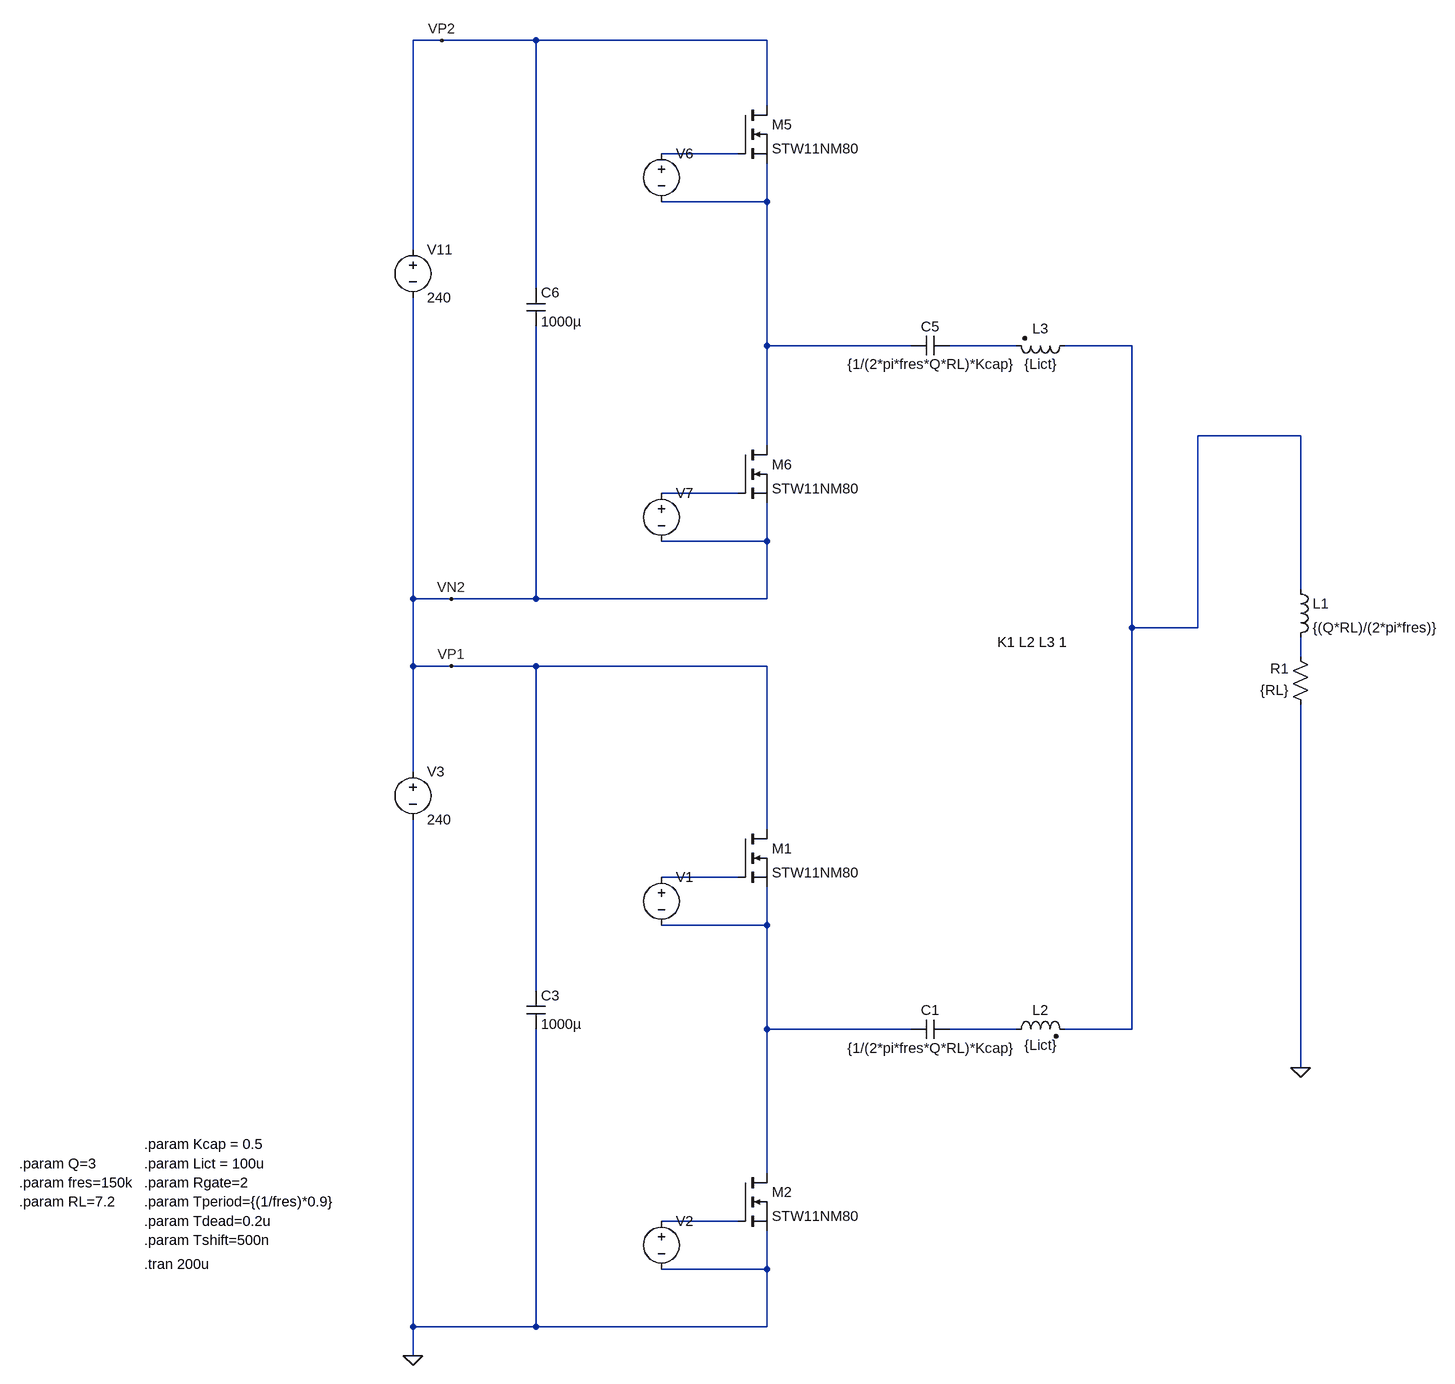
[diagram p0: schematic inv_sim12.asc]
inv_sim12.asc, the LTspice schematic file:
Version 4
SHEET 1 2752 948
WIRE -416 -1568 -464 -1568
WIRE -32 -1568 -416 -1568
WIRE 608 -1568 -32 -1568
WIRE 608 -1296 608 -1568
WIRE 560 -1216 432 -1216
WIRE 608 -1136 608 -1200
WIRE 608 -1136 432 -1136
WIRE -464 -1056 -464 -1568
WIRE -32 -992 -32 -1568
WIRE 608 -896 608 -1136
WIRE 848 -896 608 -896
WIRE 1024 -896 912 -896
WIRE 1280 -896 1104 -896
WIRE 2416 -704 1888 -704
WIRE 608 -688 608 -896
WIRE 560 -608 432 -608
WIRE 608 -528 608 -592
WIRE 608 -528 432 -528
WIRE 2416 -448 2416 -704
WIRE -464 -432 -464 -976
WIRE -400 -432 -464 -432
WIRE -32 -432 -32 -928
WIRE -32 -432 -400 -432
WIRE 608 -432 608 -528
WIRE 608 -432 -32 -432
WIRE 1280 -384 1280 -896
WIRE 1888 -384 1888 -704
WIRE 1888 -384 1280 -384
WIRE 2416 -336 2416 -368
WIRE -464 -320 -464 -432
WIRE -400 -320 -464 -320
WIRE -32 -320 -400 -320
WIRE 608 -320 -32 -320
WIRE -464 -144 -464 -320
WIRE 608 -48 608 -320
WIRE 560 32 432 32
WIRE 608 112 608 48
WIRE 608 112 432 112
WIRE -32 256 -32 -320
WIRE 608 320 608 112
WIRE 848 320 608 320
WIRE 1024 320 912 320
WIRE 1280 320 1280 -384
WIRE 1280 320 1104 320
WIRE 2416 384 2416 -256
WIRE 608 560 608 320
WIRE 560 640 432 640
WIRE 608 720 608 656
WIRE 608 720 432 720
WIRE -464 816 -464 -64
WIRE -32 816 -32 320
WIRE -32 816 -464 816
WIRE 608 816 608 720
WIRE 608 816 -32 816
WIRE -464 864 -464 816
FLAG -464 864 0
FLAG -416 -1568 VP2
FLAG -400 -432 VN2
FLAG -400 -320 VP1
FLAG 2416 384 0
SYMBOL nmos 560 -48 R0
SYMATTR InstName M1
SYMATTR Value STW11NM80
SYMBOL nmos 560 560 R0
SYMATTR InstName M2
SYMATTR Value STW11NM80
SYMBOL voltage 432 16 R0
WINDOW 3 24 96 Invisible 2
WINDOW 123 0 0 Left 2
SYMATTR Value PULSE(0 15 0 50n 50n {Tperiod / 2 - Tdead} {Tperiod})
SYMATTR InstName V1
SYMATTR SpiceLine Rser={Rgate}
SYMBOL voltage -464 -160 R0
WINDOW 123 0 0 Left 2
WINDOW 39 0 0 Left 2
SYMATTR InstName V3
SYMATTR Value 240
SYMBOL voltage 432 624 R0
WINDOW 3 24 96 Invisible 2
WINDOW 123 0 0 Left 2
SYMATTR Value PULSE(0 15 {2 * Tperiod / 4} 50n 50n {Tperiod / 2 - Tdead} {Tperiod})
SYMATTR InstName V2
SYMATTR SpiceLine Rser={Rgate}
SYMBOL ind 2400 -464 R0
SYMATTR InstName L1
SYMATTR Value {(Q*RL)/(2*pi*fres)}
SYMBOL res 2432 -240 R180
WINDOW 0 36 76 Left 2
WINDOW 3 36 40 Left 2
SYMATTR InstName R1
SYMATTR Value {RL}
SYMBOL cap -48 256 R0
SYMATTR InstName C3
SYMATTR Value 1000µ
SYMBOL nmos 560 -1296 R0
SYMATTR InstName M5
SYMATTR Value STW11NM80
SYMBOL nmos 560 -688 R0
SYMATTR InstName M6
SYMATTR Value STW11NM80
SYMBOL voltage 432 -1232 R0
WINDOW 3 24 96 Invisible 2
WINDOW 123 0 0 Left 2
SYMATTR Value PULSE(0 15 {Tshift} 50n 50n {Tperiod / 2 - Tdead} {Tperiod})
SYMATTR InstName V6
SYMATTR SpiceLine Rser={Rgate}
SYMBOL voltage 432 -624 R0
WINDOW 3 24 96 Invisible 2
WINDOW 123 0 0 Left 2
SYMATTR Value PULSE(0 15 {2 * Tperiod / 4 + Tshift} 50n 50n {Tperiod / 2 - Tdead} {Tperiod})
SYMATTR InstName V7
SYMATTR SpiceLine Rser={Rgate}
SYMBOL cap 912 -912 R90
WINDOW 0 0 32 VBottom 2
WINDOW 3 32 32 VTop 2
SYMATTR InstName C5
SYMATTR Value {1/(2*pi*fres*Q*RL)*Kcap}
SYMBOL cap -48 -992 R0
SYMATTR InstName C6
SYMATTR Value 1000µ
SYMBOL voltage -464 -1072 R0
WINDOW 123 0 0 Left 2
WINDOW 39 0 0 Left 2
SYMATTR InstName V11
SYMATTR Value 240
SYMBOL ind2 1120 -912 R90
WINDOW 0 4 56 VBottom 2
WINDOW 3 32 56 VTop 2
SYMATTR InstName L3
SYMATTR Value {Lict}
SYMATTR Type ind
SYMBOL ind2 1008 336 R270
WINDOW 0 32 56 VTop 2
WINDOW 3 5 56 VBottom 2
SYMATTR InstName L2
SYMATTR Value {Lict}
SYMATTR Type ind
SYMBOL cap 912 304 R90
WINDOW 0 0 32 VBottom 2
WINDOW 3 32 32 VTop 2
SYMATTR InstName C1
SYMATTR Value {1/(2*pi*fres*Q*RL)*Kcap}
TEXT -1064 576 Left 2 !.param Rgate=2
TEXT -1064 712 Left 2 !.tran 200u
TEXT -1064 608 Left 2 !.param Tperiod={(1/fres)*0.9}
TEXT -1064 640 Left 2 !.param Tdead=0.2u
TEXT -1272 544 Left 2 !.param Q=3
TEXT -1272 576 Left 2 !.param fres=150k
TEXT -1272 608 Left 2 !.param RL=7.2
TEXT -1064 672 Left 2 !.param Tshift=500n
TEXT -1064 544 Left 2 !.param Lict = 100u
TEXT 992 -360 Left 2 !K1 L2 L3 1
TEXT -1064 512 Left 2 !.param Kcap = 0.5

The netlist it stands for:
* inv_sim12.asc
M1 VP1 N007 N008 N008 STW11NM80
M2 N008 N010 0 0 STW11NM80
V1 N007 N008 PULSE(0 15 0 50n 50n {Tperiod / 2 - Tdead} {Tperiod}) Rser={Rgate}
V3 VP1 0 240
V2 N010 0 PULSE(0 15 {2 * Tperiod / 4} 50n 50n {Tperiod / 2 - Tdead} {Tperiod}) Rser={Rgate}
L1 N004 N006 {(Q*RL)/(2*pi*fres)}
R1 0 N006 {RL}
C3 VP1 0 1000µ
M5 VP2 N001 N002 N002 STW11NM80
M6 N002 N005 VP1 VP1 STW11NM80
V6 N001 N002 PULSE(0 15 {Tshift} 50n 50n {Tperiod / 2 - Tdead} {Tperiod}) Rser={Rgate}
V7 N005 VP1 PULSE(0 15 {2 * Tperiod / 4 + Tshift} 50n 50n {Tperiod / 2 - Tdead} {Tperiod}) Rser={Rgate}
C5 N003 N002 {1/(2*pi*fres*Q*RL)*Kcap}
C6 VP2 VP1 1000µ
V11 VP2 VP1 240
L3 N004 N003 {Lict}
L2 N009 N004 {Lict}
C1 N009 N008 {1/(2*pi*fres*Q*RL)*Kcap}
.model NMOS NMOS
.model PMOS PMOS
.lib standard.mos
.param Rgate=2
.tran 200u
.param Tperiod={(1/fres)*0.9}
.param Tdead=0.2u
.param Q=3
.param fres=150k
.param RL=7.2
.param Tshift=500n
.param Lict = 100u
K1 L2 L3 1
.param Kcap = 0.5
.backanno
.end